# EAGLE design ESP12 Low Power (EAGLE 9.6.2)
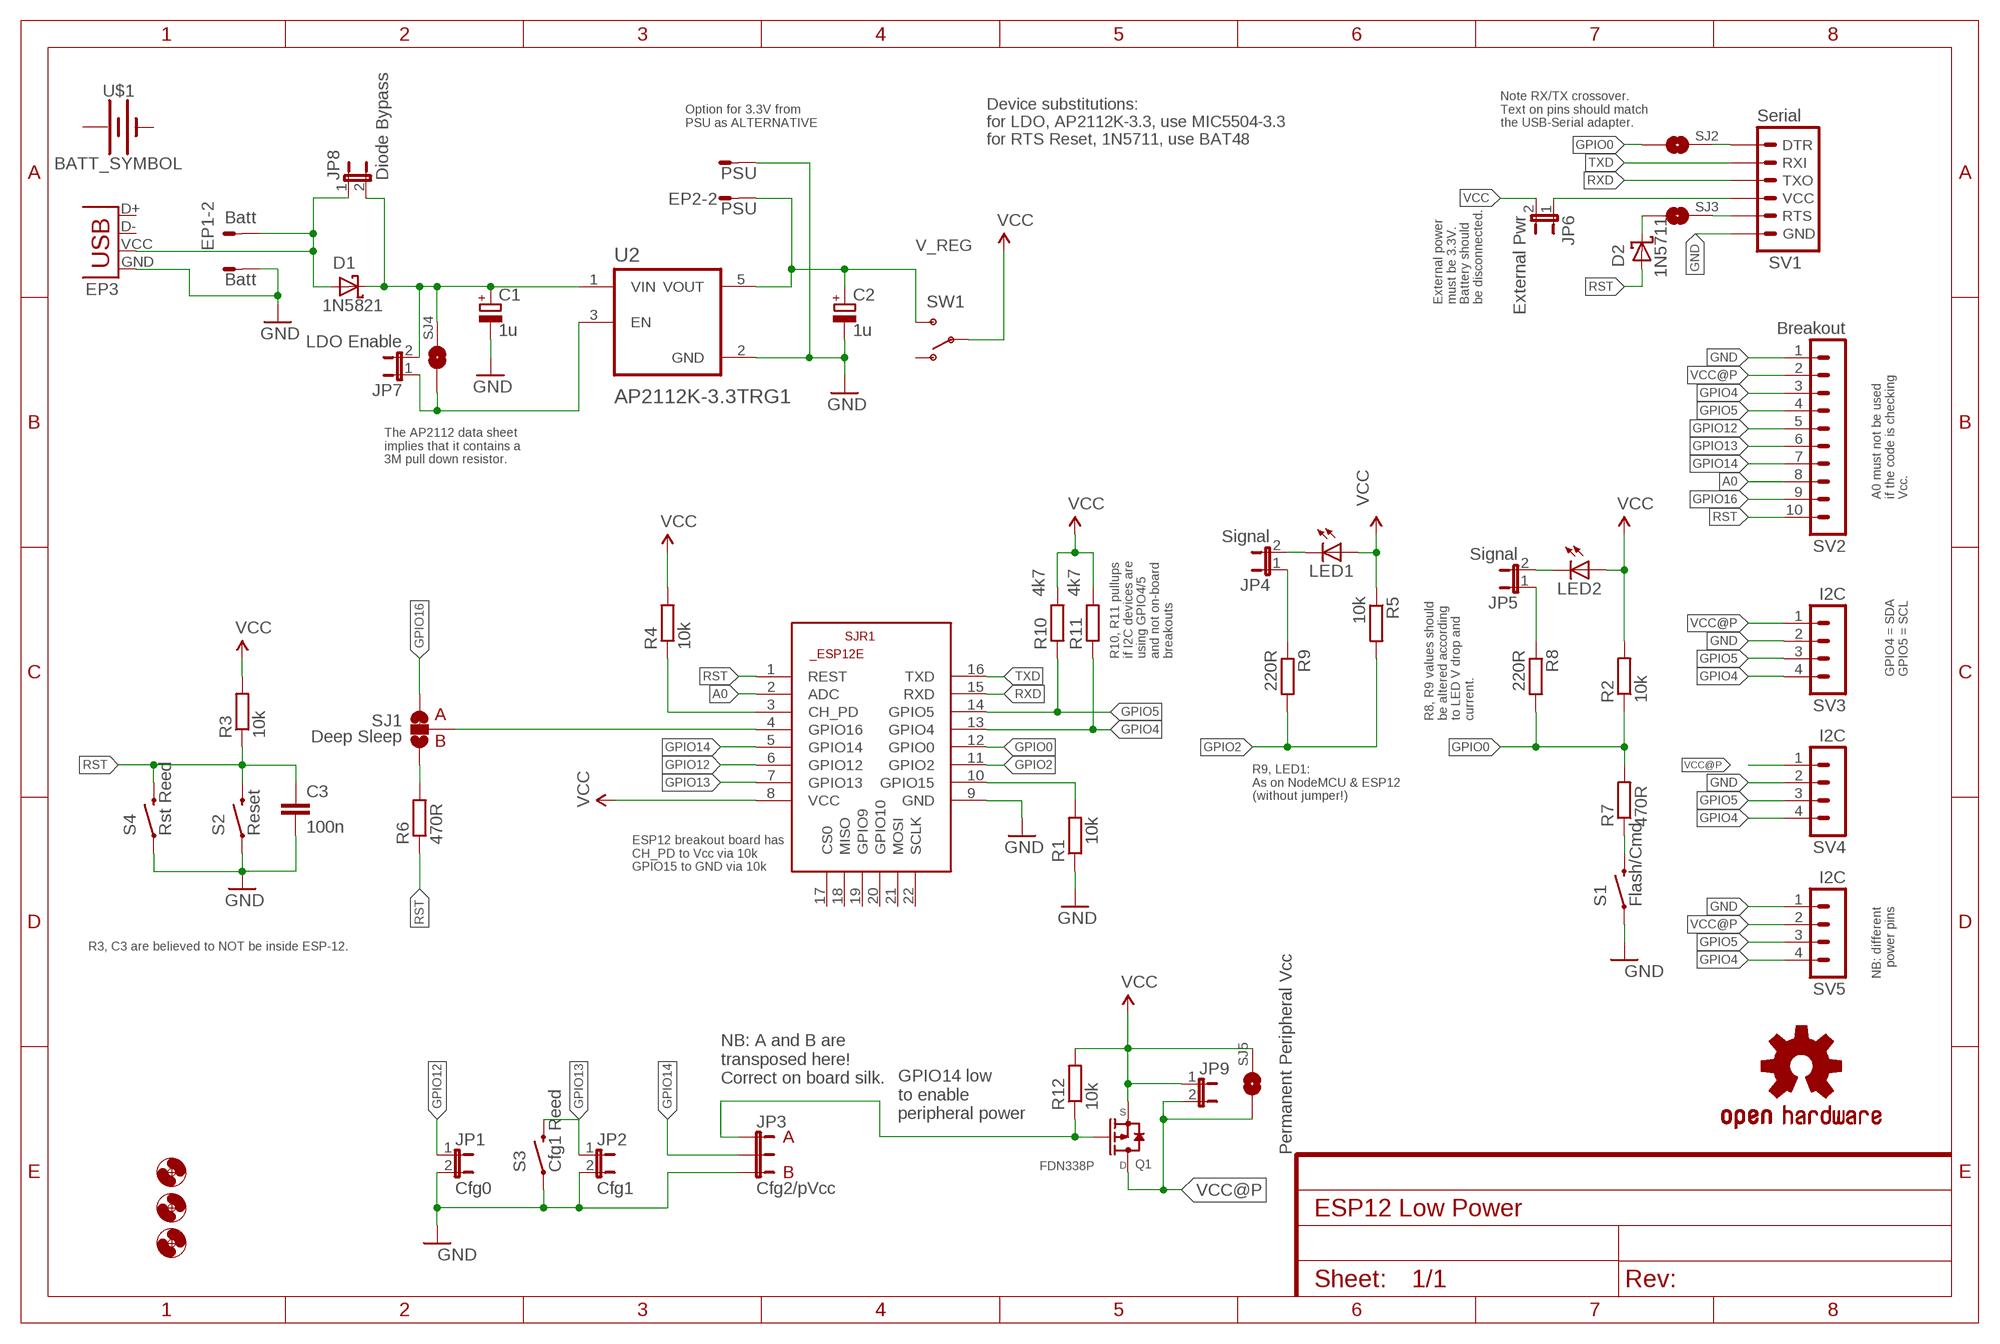
[diagram p0: schematic, sheet 1]

## Parts
C1  1u  CPOL-EUE2.5-5**10UF  [E2,5-5]
C2  1u  CPOL-EUE2.5-5**10UF  [E2,5-5]
C3  100n  C-EU1206  [1206]
D1  1N5821  DIODE-SCHOTTKYDO-201-VERT  [DO201-15]
D2  1N5711  DIODE-SCHOTTKYDO35-7  [DO35-7]
EP1  Batt  M02S  [02P]
EP2  PSU  M02S  [02P]
EP3  USB-FCI_SMD***  [FCI_USB_B_SMD]
H1  MOUNT-HOLE3.2  [3,2]
H2  MOUNT-HOLE3.2  [3,2]
H4  MOUNT-HOLE3.2  [3,2]
JP1  Cfg0  JUMPER-2PTH  [1X02]
JP2  Cfg1  JUMPER-2PTH  [1X02]
JP3  Cfg2/pVcc  JUMPER-3PTH  [1X03_JMP]
JP4  Signal  JUMPER-2PTH  [1X02]
JP5  Signal  JUMPER-2PTH  [1X02]
JP6  External Pwr  JUMPER-2PTH  [1X02]
JP7  LDO Enable  JUMPER-2PTH  [1X02]
JP8  Diode Bypass  JUMPER-2PTH  [1X02]
JP9  Permanent Peripheral Vcc  JUMPER-2PTH  [1X02]
LED1  LED1206  [LED-1206]
LED2  LED1206  [LED-1206]
LOGO1  OSHW-LOGOM  [OSHW-LOGO-M]
Q1  FDN338P  FDN338P_PMOS-SOT23  [SOT23]
R1  10k  R-EU_  [1206]
R2  10k  R-EU_  [1206]
R3  10k  R-EU_  [1206]
R4  10k  R-EU_  [1206]
R5  10k  R-EU_  [1206]
R6  470R  R-EU_0204/7**  [0204/7]
R7  470R  R-EU_0204/7**  [0204/7]
R8  220R  R-EU_0204/7**  [0204/7]
R9  220R  R-EU_0204/7**  [0204/7]
R10  4k7  R-EU_  [1206]
R11  4k7  R-EU_  [1206]
R12  10k  R-EU_0204/7**  [0204/7]
S1  Flash/Cmd  SWITCH-MOMENTARY-2PTH  [TACTILE-PTH]
S2  Reset  SWITCH-MOMENTARY-2PTH  [TACTILE-PTH]
S3  Cfg1 Reed  SWITCH-MOMENTARY-2PTH_REED  [REED_SWITCH_PTH]
S4  Rst Reed  SWITCH-MOMENTARY-2PTH_REED  [REED_SWITCH_PTH]
SJ1  Deep Sleep  SOLDERJUMPER_2WAYSJ_3_TRACE  [SJ_3]
SJ2  SOLDERJUMPERTRACE  [SJ_2S-TRACE]
SJ3  SOLDERJUMPERTRACE  [SJ_2S-TRACE]
SJ4  SOLDERJUMPERTRACE  [SJ_2S-TRACE]
SJ5  SOLDERJUMPERTRACE  [SJ_2S-TRACE]
SJR1  ESP8266-12EESP12E  [ESP8266-ESP12E]
SV1  Serial  ESP8266_SERIAL_PROGRAM1X06_ESP_SERIAL  [1X06-KIT]
SV2  Breakout  HEADER-1X10P  [MA10-1]
SV3  I2C  MA04-1  [MA04-1]
SV4  I2C  MA04-1  [MA04-1]
SV5  I2C  MA04-1  [MA04-1]
SW1  SWITCH_SPDTMULTICOMP_MS2  [MULTICOMP_2MS]
U2  AP2112K-3.3TRG1  [SOT95P285X140-5N]
U$1  BATT_SYMBOL  [BATTERY_18650-HOLDER_SILK]

## Nets
A0: SJR1.2(ADC) SV2.8
GND: C1.- C2.- C3.2 EP1.2 EP2.1 EP3.GND JP1.2 JP2.2 JP3.3 R1.1 S1.1 S2.1 S3.P$1 S4.P$1 SJR1.9(GND) SV1.1(GND) SV2.1 SV3.2 SV4.2 SV5.1 U2.2(GND)
GPIO0: R2.1 R7.2 R8.2 SJ2.1 SJR1.12(GPIO0)
GPIO2: R5.2 R9.2 SJR1.11(GPIO2)
GPIO4: R11.1 SJR1.13(GPIO4) SV2.3 SV3.4 SV4.4 SV5.4
GPIO5: R10.1 SJR1.14(GPIO5) SV2.4 SV3.3 SV4.3 SV5.3
GPIO12: JP1.1 SJR1.6(GPIO12) SV2.5
GPIO13: JP2.1 S3.P$2 SJR1.7(GPIO13) SV2.6
GPIO14: JP3.2 SJR1.5(GPIO14) SV2.7
GPIO16: SJ1.1 SV2.9
N$1: R7.1 S1.3
N$2: R1.2 SJR1.10(GPIO15)
N$3: JP7.1 SJ4.1 U2.3(EN)
N$4: JP4.2 LED1.C
N$5: SJ3.2 SV1.2(RTS)
N$6: JP4.1 R9.1
N$7: JP5.2 LED2.C
N$8: C1.+ D1.C JP7.2 JP8.2 SJ4.2 U2.1(VIN)
N$9: JP6.1 SV1.3(VCC)
N$10: SJ2.2 SV1.6(DTR)
N$11: R6.2 SJ1.3
N$12: SJ1.2 SJR1.4(GPIO16)
N$13: D1.A EP1.1 EP3.VCC(VBUS) JP8.1
N$14: D2.C SJ3.1
N$15: JP5.1 R8.1
N$16: R4.1 SJR1.3(CH_PD)
N$17: JP3.1 Q1.1(G) R12.1
RST: C3.1 D2.A R3.1 R6.1 S2.3 S4.P$2 SJR1.1(REST) SV2.10
RXD: SJR1.15(RXD) SV1.4(TXO)
TXD: SJR1.16(TXD) SV1.5(RXI)
V_REG: C2.+ EP2.2 SW1.P$3(S) U2.5(VOUT)
VCC: JP6.2 JP9.1 LED1.A LED2.A Q1.2(S) R2.2 R3.2 R4.2 R5.1 R10.2 R11.2 R12.2 SJ5.2 SJR1.8(VCC) SW1.P$2(P)
VCC@P: JP9.2 Q1.3(D) SJ5.1 SV2.2 SV3.1 SV4.1 SV5.2
Unconnected: EP3.D+ EP3.D- SJR1.17(CS0) SJR1.18(MISO) SJR1.19(GPIO9) SJR1.20(GPIO10) SJR1.21(MOSI) SJR1.22(SCLK) SW1.P$1(O)

## Notes on the sheet
- Option for 3.3V from
  PSU as ALTERNATIVE
- Note RX/TX crossover.
  Text on pins should match
  the USB-Serial adapter.
- Device substitutions:
  for LDO, AP2112K-3.3, use MIC5504-3.3
  for RTS Reset, 1N5711, use BAT48
- External power
  must be 3.3V.
  Battery should
  be disconnected.
- The AP2112 data sheet
  implies that it contains a
  3M pull down resistor.
- A0 must not be used
  if the code is checking
  Vcc.
- R10, R11 pullups
  if I2C devices are
  using GPIO4/5
  and not on-board
  breakouts
- GPIO4 = SDA
  GPIO5 = SCL
- R8, R9 values should
  be altered according
  to LED V drop and
  current.
- R9, LED1:
  As on NodeMCU & ESP12
  (without jumper!)
- ESP12 breakout board has
  CH_PD to Vcc via 10k
  GPIO15 to GND via 10k
- NB: different
  power pins
- R3, C3 are believed to NOT be inside ESP-12.
- NB: A and B are
  transposed here!
  Correct on board silk.
- GPIO14 low
  to enable
  peripheral power

## Library data of the parts
C1 C2 = Master 2016:CPOL-EU: POLARIZED CAPACITOR, European symbol
C3 = Master 2016:C-EU: CAPACITOR, European symbol
D1 D2 = Master 2016:DIODE-SCHOTTKY: DIODE high speed (Philips)
EP1 EP2 = con-amp-quick:M02S: AMP QUICK CONNECTOR; OC_FARNELL: unknown; OC_NEWARK: unknown
EP3 = Master 2016:USB: USB Connectors USB-B-PTH is fully proven SKU : PRT-00139 USB-miniB is fully proven SKU : PRT-00587 USB-A-PCB is untested. USB-A-H is throughly reviewed, but untested. Spark Fun Electronics SKU : PRT-00437 USB-B-SMT is throughly reviewed, but untested. Needs silkscreen touching up. USB-A-S has not been used/tested USB-MB-H has not been used/tested
H1 H2 H4 = Master 2016:MOUNT-HOLE: MOUNTING HOLE with drill center marker
JP1 JP2 JP4-JP9 = SparkFun-Passives:JUMPER-2: Jumper Basic 0.1" spaced jumper. Use with breakaway headers.
JP3 = Master 2016:JUMPER-3
LED1 LED2 = Master 2016:LED: LEDs Standard schematic elements and footprints for 5mm, 3mm, 1206, and 0603 sized LEDs. 5mm - Spark Fun Electronics SKU : COM-00529 (and others)
LOGO1 = Master 2016:OSHW-LOGO: Open Source Hardware Logo This logo indicates the piece of hardware it is found on incorporates a OSHW license and/or adheres to the definition of open source hardware found here: http://freedomdefined.org/OSHW
Q1 = Master 2016:FDN338P_PMOS: Si2305DS Si2323CDS
R1-R12 = Master 2016:R-EU_: RESISTOR, European symbol
S1-S4 = Master 2016:SWITCH-MOMENTARY-2: Various NO switches- pushbuttons, reed, etc
SJ1 = Master 2016:SOLDERJUMPER_2WAY: Solder Jumper 2 way solder jumper
SJ2-SJ5 = Master 2016:SOLDERJUMPER: Solder Jumper Standard SMD solder jumper. Used to automate production. Two varients : Normally Open and Normally Closed are the same, but have different paste layers. NC will have a large amount of paste and should jumper during reflow.
SJR1 = esp12e:ESP8266-12E: ESP8266-12E Library for Eagle CAD The author not responsible for any damages or errors!. Created by Suhail jr.lt;/author>
SV1 = Master 2016:ESP8266_SERIAL_PROGRAM
SV2 = Master 2016:HEADER-1X10P: PIN HEADER; OC_FARNELL: unknown; OC_NEWARK: unknown
SV3-SV5 = Master:MA04-1: PIN HEADER; OC_FARNELL: unknown; OC_NEWARK: unknown
SW1 = Master 2016:SWITCH_SPDT: Side-actuated SPDT slide switch, as used on the Arduino Pro
U2 = AP2112K-3.3TRG1:AP2112K-3.3TRG1: AP2112 Series 0.6 A 3.3 V Fixed Output SMT LDO Linear Regulator - SOT23-5; AVAILABILITY: Unavailable; DESCRIPTION: Linear Voltage Regulator IC 1 Output 600mA SOT-25; MF: Diodes Inc.; MP: AP2112K-3.3TRG1; PACKAGE: SOT-753 Diodes Inc.; PRICE: None
U$1 = Master 2016:BATT_SYMBOL: This is a battery symbol and silk-screen placement only. Use a separate solder-point component. Intended for cases when a battery holder with flying leads will be used, but when freedom of placement of the solder connections is needed, or when the batt holder might be replaced by an off-board battery in some builds of the PCB.

## Board
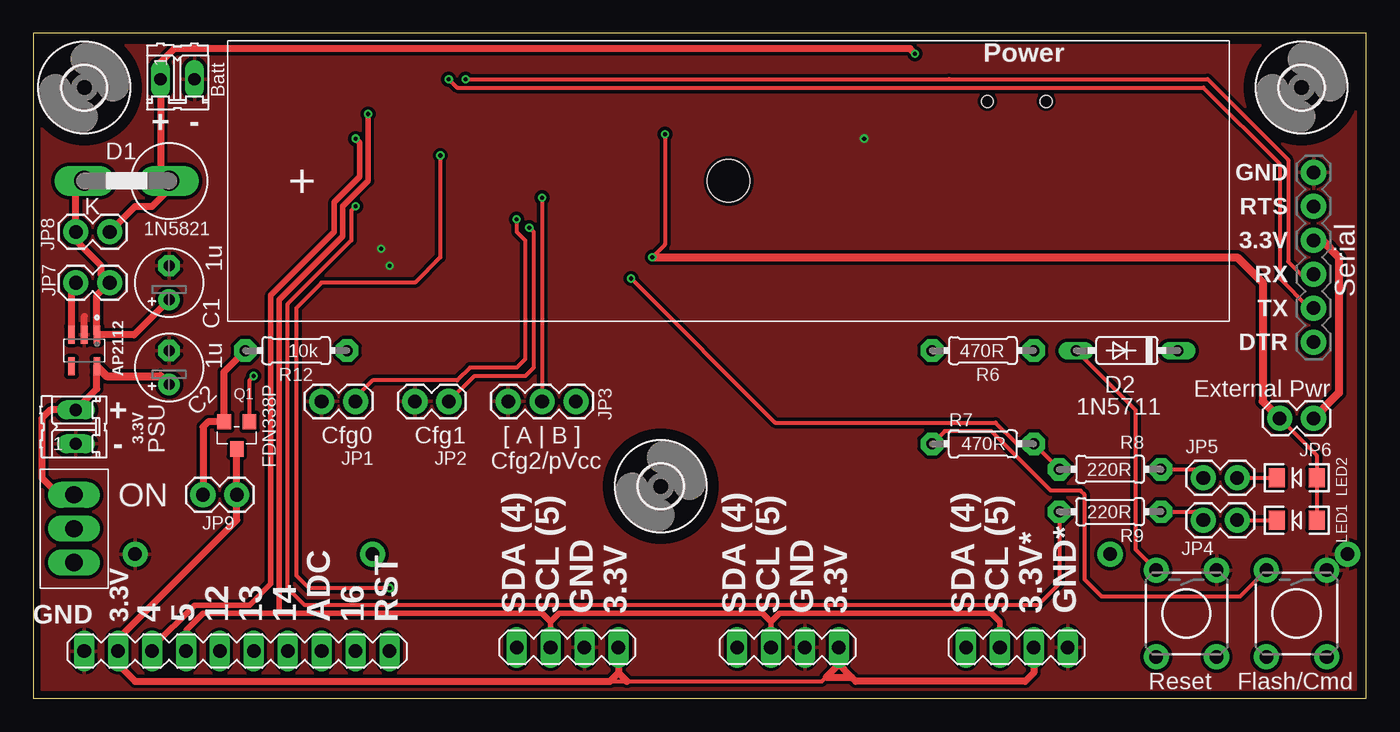
[diagram p1: board, top side]
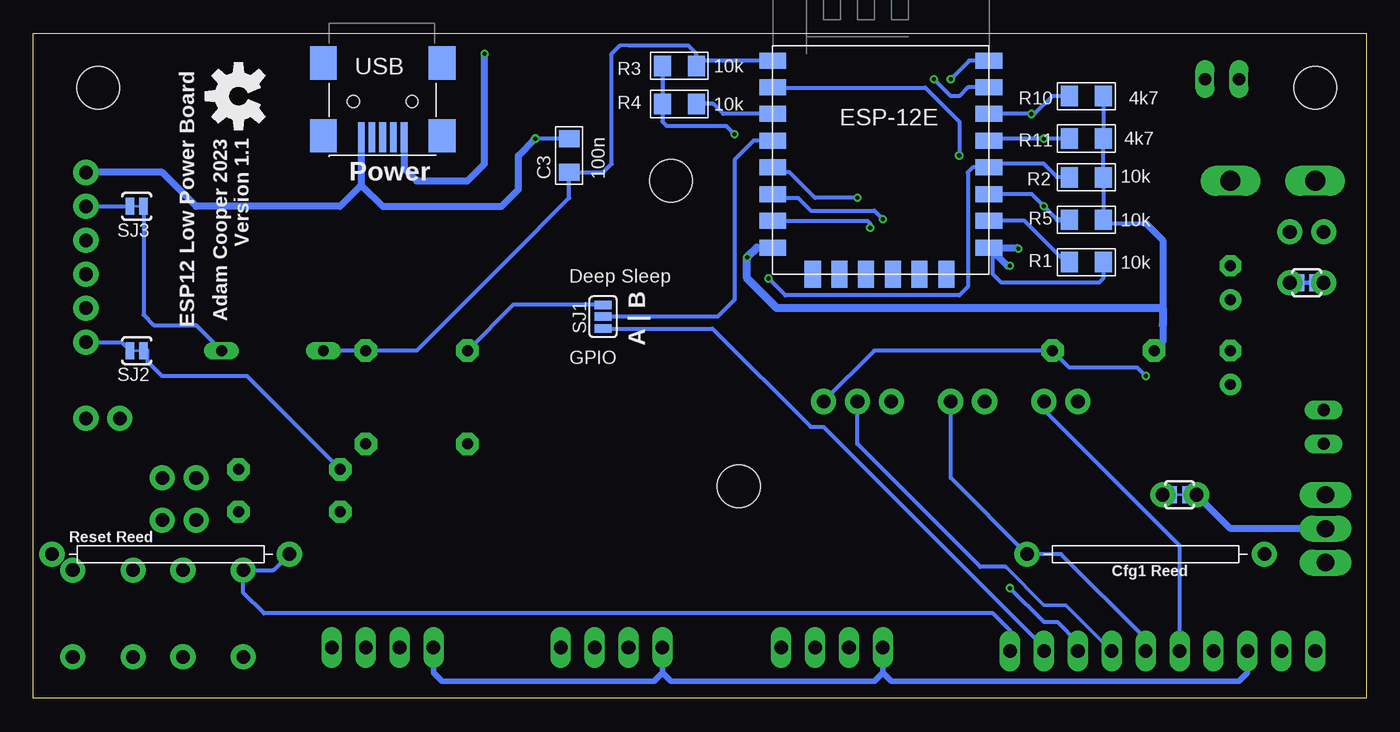
[diagram p2: board, bottom side, seen from below]

Size 99.82 x 49.78 mm. Coordinates in mm from the lower left corner, seen from the top.
Outline: 0,0 99.82,0 99.82,49.78 0,49.78 0,0
Copper layers (1*16): Top 0.035mm / dielectric 1.5mm / Bottom 0.035mm
Design rules "Seeed Fusion_eagle_rule_v1.1": minimum track width 6mil, minimum drill 12mil, track to track 6mil, track to pad 6mil, pad to pad 6mil, via to via 6mil, smd to smd 0mil, copper to edge 10mil, drill to drill 10mil, minimum pad ring 10mil, minimum via ring 6mil, stop-mask expansion 2mil, vias tented up to drill 100mil, thermal gap 10mil

### Footprints (pad centres in the part's own frame; a part is rotated, then mirrored left to right if it is on the bottom)
E2,5-5 = drill 0.813 pad 1.6: + -1.27,0 | drill 0.813 pad 1.6 octagon: - 1.27,0
1206 = smd 1.27 x 1.524: 1 -1.27,0; 2 1.27,0
DO201-15 = drill 1.499 long: A 0,0; C -6.35,0
DO35-7 = drill 0.813 long: A 3.81,0; C -3.81,0
02P = drill 0.914 long: 1 -1.27,0; 2 1.27,0
FCI_USB_B_SMD = smd 0.5 x 2.25: D+ 0,8.525; D- -0.8,8.525; GND 1.6,8.525; ID 0.8,8.525; VCC -1.6,8.525 | smd 2 x 2.5: SH$1 -4.45,8.43; SH$2 4.45,8.43; SH$3 4.45,2.98; SH$4 -4.45,2.98 | hole 0.9: -2.2,5.85; 2.2,5.85
3,2 = hole 3.2: 0,0
1X02 = drill 1.016 pad 1.88: 1 0,0; 2 2.54,0
1X03_JMP = drill 1.016 pad 1.88: 1 0,0; 2 2.54,0; 3 5.08,0
LED-1206 = smd 1.2 x 1.4: A -1.5,0; C 1.5,0
SOT23 = smd 1.016 x 1.143: 1 -0.95,-1.016; 2 0.95,-1.016; 3 0,1.016
0204/7 = drill 0.813 pad 1.676 octagon: 1 -3.81,0; 2 3.81,0
TACTILE-PTH = drill 1.016 pad 1.88: 1 -3.251,2.261; 2 3.251,2.261; 3 -3.251,-2.261; 4 3.251,-2.261
REED_SWITCH_PTH = drill 1.016 pad 1.88: P$1 -8.89,0; P$2 8.89,0
SJ_3 = smd 0.635 x 1.27: 1 -0.889,0; 2 0,0; 3 0.889,0
SJ_2S-TRACE = smd 0.635 x 1.27: 1 -0.508,0; 2 0.508,0
ESP8266-ESP12E = smd 2 x 1.2: 1 -7.62,5.84; 2 -7.62,3.84; 3 -7.62,1.84; 4 -7.62,-0.16; 5 -7.62,-2.16; 6 -7.62,-4.16; 7 -7.62,-6.16; 8 -7.62,-8.16; 9 8.58,-8.16; 10 8.58,-6.16; 11 8.58,-4.16; 12 8.58,-2.16; 13 8.58,-0.16; 14 8.58,1.84; 15 8.58,3.84; 16 8.58,5.84 | smd 1.2 x 2: 17 -4.62,-10.16; 18 -2.62,-10.16; 19 -0.62,-10.16; 20 1.38,-10.16; 21 3.38,-10.16; 22 5.38,-10.16
1X06-KIT = drill 1.016 pad 1.88: 1 0,0; 2 2.54,0; 3 5.08,0; 4 7.62,0; 5 10.16,0; 6 12.7,0
MA10-1 = drill 1.016 long: 1 -11.43,0; 2 -8.89,0; 3 -6.35,0; 4 -3.81,0; 5 -1.27,0; 6 1.27,0; 7 3.81,0; 8 6.35,0; 9 8.89,0; 10 11.43,0
MA04-1 = drill 1.016 long: 1 -3.81,0; 2 -1.27,0; 3 1.27,0; 4 3.81,0
MULTICOMP_2MS = drill 1.3 pad 1.93 long: P$1 -2.54,0; P$2 0,0; P$3 2.54,0
SOT95P285X140-5N = smd 1.35 x 0.6: 1 -1.185,0.95; 2 -1.185,0; 3 -1.185,-0.95; 4 1.185,-0.95; 5 1.185,0.95
BATTERY_18650-HOLDER_SILK = hole 3.2: 0,0

### Placement (x,y rotation side)
C1  10.16,31.11 90 top
C2  10.16,24.77 90 top
C3  59.69,40.64 90 bottom
D1  10.16,38.73 0 top
D2  81.92,26.04 180 top
EP1  10.79,46.35 0 top
EP2  3.17,20.32 90 top
EP3  73.66,50.55 180 bottom
H1  94.98,45.72 0 top
H2  46.99,15.88 0 top
H4  3.81,45.72 0 top
JP1  24.13,22.23 180 top
JP2  31.11,22.23 180 top
JP3  40.64,22.23 180 top
JP4  87.63,13.34 0 top
JP5  87.63,16.51 0 top
JP6  95.89,20.95 180 top
JP7  3.17,31.11 0 top
JP8  5.71,34.92 180 top
JP9  12.7,15.24 0 top
LED1  94.61,13.34 180 top
LED2  94.61,16.51 180 top
LOGO1  84.45,45.09 90 bottom
Q1  15.24,19.68 180 top
R1  20.95,32.66 180 bottom
R2  20.95,39.01 0 bottom
R3  51.44,47.35 180 bottom
R4  51.44,44.5 180 bottom
R5  20.95,35.83 180 bottom
R6  71.12,26.04 180 top
R7  71.12,19.05 0 top
R8  80.64,17.14 180 top
R9  80.64,13.97 180 top
R10  20.95,45.09 0 bottom
R11  20.95,41.91 0 bottom
R12  19.68,26.04 180 top
S1  94.61,6.35 270 top
S2  86.36,6.35 270 top
S3  16.51,10.79 180 bottom
S4  89.53,10.79 0 bottom
SJ1  57.15,28.57 90 bottom
SJ2  92.08,26.04 180 bottom
SJ3  92.08,36.83 180 bottom
SJ4  4.45,31.11 0 bottom
SJ5  13.97,15.24 0 bottom
SJR1  36.83,41.91 0 bottom
SV1  95.89,39.37 270 top
SV2  15.24,3.54 0 top
SV3  40.01,3.81 180 top
SV4  56.52,3.81 180 top
SV5  73.66,3.81 180 top
SW1  3.05,12.7 90 top
U2  3.81,26.04 270 top
U$1  52.07,38.73 0 top

### Tracks (layer width: path | path; a pad name or v marks a point on that pad's centre or on a via)
A0  (via drill 0.3 pad 0.61)
  Top 0.305: v30.48,40.64 30.48,33.02 28.57,31.11 21.59,31.11 19.68,29.21 19.68,9.21 20.64,8.26 v26.67,8.26
  Bottom 0.305: SJR1.2 44.42,45.72 33.02,45.72 30.48,43.18 v30.48,40.64 | v26.67,8.26 24.13,5.71 23.13,5.71 21.59,4.17 SV2.8
GND  (via drill 0.3 pad 0.61)
  Top 0.508: U2.2 3.81,28.57
  Bottom 0.305: SJR1.9 27.94,33.75 27.94,31.75 27.3,31.11 20,31.11 19.68,31.43 R1.1 | 26.13,33.75 v26.04,33.66 | 26.89,32.38 v26.67,32.38 | C3.2 v62.23,41.91
  Bottom 0.508: 27.94,33.75 26.13,33.75 | SJR1.9 26.89,32.38 | EP3.GND 75.26,38.43 | 75.26,38.43 73.66,36.83 64.77,36.83 63.5,38.1 63.5,40.64 v62.23,41.91 | 75.26,38.43 76.86,36.83 87.63,36.83 90.17,39.37 SV1.1
  pour Top (isolate 0.254): 0.64,0.64 0.64,48.9 99.06,48.9 99.06,0.64
GPIO0  (via drill 0.3 pad 0.61)
  Top 0.305: R8.2 R7.2 73.66,19.05 72.07,20.64 55.56,20.64 v44.77,31.43
  Bottom 0.305: R2.1 23.13,39.01 24.13,40.01 28,40.01 SJR1.12 29.46,39.75 29.84,39.37 29.84,30.8 30.48,30.16 43.5,30.16 v44.77,31.43 | R8.2 83.82,24.13 90.17,24.13 91.29,25.25 91.29,26.04 SJ2.1
GPIO2  (via drill 0.3 pad 0.61)
  Top 0.305: R9.2 76.83,8.57 75.25,6.99 20.32,6.99 19.05,8.26 19.05,29.53 23.81,34.29 23.81,36.51 v24.13,36.83
  Bottom 0.305: SJR1.11 25.05,37.75 v24.13,36.83 23.13,35.83
  Bottom 0.406: R5.2 23.13,35.83
GPIO4  (via drill 0.3 pad 0.61)
  Top 0.406: SV2.3 8.89,3.81 12.06,6.99 16.19,6.99 17.78,8.57 17.78,30.16 22.54,34.92 22.54,37.15 24.45,39.05 24.45,41.59 v24.13,41.91
  Bottom 0.305: R11.1 v24.13,41.91 28.09,41.91 SJR1.13
  Bottom 0.406: SV2.3 8.89,1.91 9.53,1.27 35.56,1.27 36.2,1.91 | 36.2,1.91 SV3.4 | 36.2,1.91 36.83,1.27 52.07,1.27 52.7,1.91 | 52.7,1.91 SV4.4 | 52.7,1.91 53.34,1.27 69.22,1.27 69.85,1.91 SV5.4
GPIO5  (via drill 0.3 pad 0.61)
  Top 0.406: 55.24,5.71 55.88,6.35 71.75,6.35 72.39,5.71 SV5.3 | SV3.3 38.73,5.71 | 38.73,5.71 39.37,6.35 54.61,6.35 55.24,5.71 | 55.24,5.71 SV4.3 | SV2.4 11.43,5.08 12.7,6.35 18.41,6.35 | 18.41,6.35 38.1,6.35 38.73,5.71 | 18.41,6.35 18.41,29.84 23.18,34.61 23.18,36.83 25.08,38.73 v25.08,43.75
  Bottom 0.305: R10.1 23.5,45.09 24.83,43.75 v25.08,43.75 SJR1.14
GPIO12  (via drill 0.3 pad 0.61)
  Top 0.305: v36.2,35.88 36.2,34.92 36.83,34.29 36.83,25.4 36.2,24.77 32.7,24.77 31.75,23.81 25.4,23.81 24.13,22.54 JP1.1
  Bottom 0.305: SV2.5 13.97,11.43 24.13,21.59 JP1.1 | SJR1.6 44.16,37.47 42.55,37.47 41.59,36.51 36.83,36.51 v36.2,35.88
GPIO13  (via drill 0.3 pad 0.61)
  Top 0.305: v37.15,35.24 37.47,34.92 37.47,24.77 36.83,24.13 33.02,24.13 JP2.1
  Bottom 0.305: SJR1.7 37.34,35.75 37.15,35.56 v37.15,35.24 | SV2.6 16.51,4.45 22.86,10.79 S3.P$2 31.11,16.51 JP2.1
GPIO14  (via drill 0.3 pad 0.61)
  Top 0.305: v38.1,37.47 JP3.2
  Bottom 0.254: SV2.7 22.5,6.99 24.13,6.99 26.99,9.84
  Bottom 0.305: 26.99,9.84 28.89,9.84 38.1,19.05 JP3.2 | SJR1.5 44.07,39.37 43.18,39.37 41.27,37.47 v38.1,37.47
GPIO16
  Bottom 0.305: SV2.9 24.13,3.81 40.64,20.32 41.59,20.32 48.96,27.69 SJ1.1
N$1
  Top 0.305: S1.3 90.37,7.62 80.01,7.62 78.74,8.89 78.74,15.24 78.42,15.56 76.2,15.56 71.75,20 68.26,20 R7.1
N$2
  Bottom 0.305: R1.2 22.5,32.66 25.59,35.75 SJR1.10
N$3
  Top 0.508: U2.3 2.86,30.8 JP7.1
  Bottom 0.305: SJ4.1 JP7.1
N$4
  Top 0.305: JP4.2 LED1.C
N$5
  Bottom 0.305: SV1.2 SJ3.2
N$6
  Top 0.305: R9.1 87,13.97 JP4.1
N$7
  Top 0.305: JP5.2 LED2.C
N$8
  Top 0.305: 3.17,34.29 JP8.2
  Top 0.508: C1.+ 7.54,27.22 U2.1 4.76,30.16 JP7.2 5.08,31.75 5.08,32.38 3.17,34.29 | JP8.2 3.17,38.1 D1.C
  Bottom 0.305: SJ4.2 JP7.2
N$9
  Top 0.61: SV1.3 96.52,34.29 97.79,33.02 97.79,22.86 JP6.1
N$10
  Bottom 0.305: SV1.6 93.22,26.67 SJ2.2
N$11
  Bottom 0.305: SJ1.3 63.88,29.46 R6.2
N$12
  Bottom 0.305: SJR1.4 45.88,41.75 47.31,40.32 47.31,29.84 48.58,28.57 SJ1.2
N$13  (via drill 0.3 pad 0.61)
  Top 0.508: JP8.1 7.62,36.83 8.89,36.83 10.16,38.1 D1.A 9.53,39.37 EP1.1 9.53,47.62 10.54,48.64 65.66,48.64 v66.04,48.26
  Bottom 0.508: EP3.VCC 72.06,39.67 71.12,38.73 67.31,38.73 66.04,40.01 v66.04,48.26
N$14
  Bottom 0.305: D2.C 87.63,27.94 90.81,27.94 91.57,28.7 SJ3.1
N$15
  Top 0.305: R8.1 87,17.14 JP5.1
N$16
  Bottom 0.305: SJR1.3 48.15,43.75 48.9,44.5 R4.1
N$17  (via drill 0.3 pad 0.61)
  Top 0.305: Q1.1 16.19,23.81 v16.51,24.13
  Bottom 0.305: JP3.1 36.83,26.04 R12.1 22.23,24.77 17.14,24.77 v16.51,24.13
RST
  Top 0.305: D2.A 82.55,21.59 82.55,11.15 S2.3
  Bottom 0.254: 55.88,48.9 55.24,48.9
  Bottom 0.305: SJR1.1 49.77,47.75 R3.1 50.16,48.26 50.8,48.9 55.24,48.9 | D2.A R6.1 71.12,26.04 64.45,32.7 64.14,33.02 59.69,37.47 C3.1 57.15,39.37 56.52,40.01 56.52,48.26 55.88,48.9 | SV2.10 26.67,5.08 27.94,6.35 82.55,6.35 84.1,7.9 S2.3 81.84,9.6 S4.P$2
RXD  (via drill 0.3 pad 0.61)
  Top 0.305: v32.38,46.35 68.58,46.35 87.95,46.35 93.98,40.32 93.98,32.7 94.93,31.75 SV1.4
  Bottom 0.305: SJR1.15 29.82,45.75 30.48,45.09 31.11,45.09 v32.38,46.35
TXD  (via drill 0.3 pad 0.61)
  Top 0.305: v31.11,46.35 31.75,45.72 87.63,45.72 93.34,40.01 93.34,31.43 95.57,29.21 SV1.5
  Bottom 0.305: SJR1.16 29.72,47.75 v31.11,46.35
V_REG
  Top 0.508: U2.5 4.76,23.18 EP2.2 1.27,21.59 0.64,20.95 0.64,16.51 1.91,15.24 SW1.P$3
  Top 0.61: U2.5 5.48,24.13 9.53,24.13 C2.+
VCC  (via drill 0.3 pad 0.61)
  Top 0.305: JP6.2 96.11,18.18 LED2.A LED1.A | v47.31,42.23 47.31,33.97 v46.35,33.02
  Top 0.508: R12.2 14.29,24.45 Q1.2 13.08,20.7 12.7,20.32 JP9.1
  Top 0.61: v46.35,33.02 90.17,33.02 92.08,31.11 92.08,22.23 JP6.2
  Bottom 0.305: R10.2 R11.2 R2.2 R5.1 19.41,35.56 16.51,35.56 | R3.2 R4.2 52.7,43.18 52.39,42.86 47.94,42.86 v47.31,42.23 | SJR1.8 45.62,33.75
  Bottom 0.508: 16.51,35.56 15.24,34.29 15.24,29.21 | SW1.P$2 10.16,12.7 JP9.1 SJ5.2 | 15.24,27.94 15.24,26.67 R12.2
  Bottom 0.61: 15.24,27.94 15.24,29.21 44.13,29.21 46.35,31.43 v46.35,33.02 45.62,33.75
VCC@P
  Top 0.305: 60.33,2.54 SV4.1 | 43.18,1.27 44.45,1.27 59.05,1.27 59.37,1.59
  Top 0.508: 43.81,1.91 43.18,1.27 7.62,1.27 6.35,2.54 SV2.2 6.35,4.45 15.24,13.34 JP9.2 Q1.3 | SV5.2 74.93,1.91 74.3,1.27 61.59,1.27 61.28,1.59 | 61.28,1.59 60.33,2.54 59.37,1.59 61.28,1.59 | SV3.1 43.81,1.91 | 43.81,1.91 44.45,1.27
  Bottom 0.508: SJ5.1 JP9.2

### Text on the board
tPlace: + | - | GND | RTS | 3.3V | RX | TX | DTR | + | - | 3.3V | GND | 3.3V | 4 | 5 | 12 | 13 | 14 | ADC | 16 | RST | SDA (4) | SCL (5) | GND | 3.3V | SDA (4) | SCL (5) | GND | 3.3V | SDA (4) | SCL (5) | 3.3V* | GND*
bPlace: ESP12 Low Power Board | Adam Cooper 2023 / Version 1.1
tNames: Power | AP2112 | ON
bNames: Power | A | B | GPIO | Reset Reed | Cfg1 Reed
_tNames: D1 | D1 | JP8 | JP8 | JP7 | JP7 | C1 | C1 | R12 | R12 | R6 | R6 | C2 | C2 | D2 | D2 | Q1 | Q1 | JP3 | JP3 | R7 | R7 | R8 | R8 | JP6 | JP6 | JP1 | JP1 | JP2 | JP2 | JP5 | JP5 | LED2 | LED2 | LED1 | LED1 | JP9 | JP9 | R9 | R9 | JP4 | JP4
_bNames: R3 | R3 | R4 | R4 | R10 | R11 | R11 | C3 | C3 | R2 | R2 | R5 | R5 | SJ3 | SJ3 | R1 | R1 | SJ1 | SJ1 | SJ2 | SJ2
_tFinish: Q1
_bFinish: R10
_tDocu: EP1 | U$1 | U2 | U2 | U2 | U2 | EP2 | S2 | S1
_bDocu: R10 | SJR1